# Altium schematic sheet A2.SchDoc
size A3; SheetNumber: 3; SheetTotal: 6
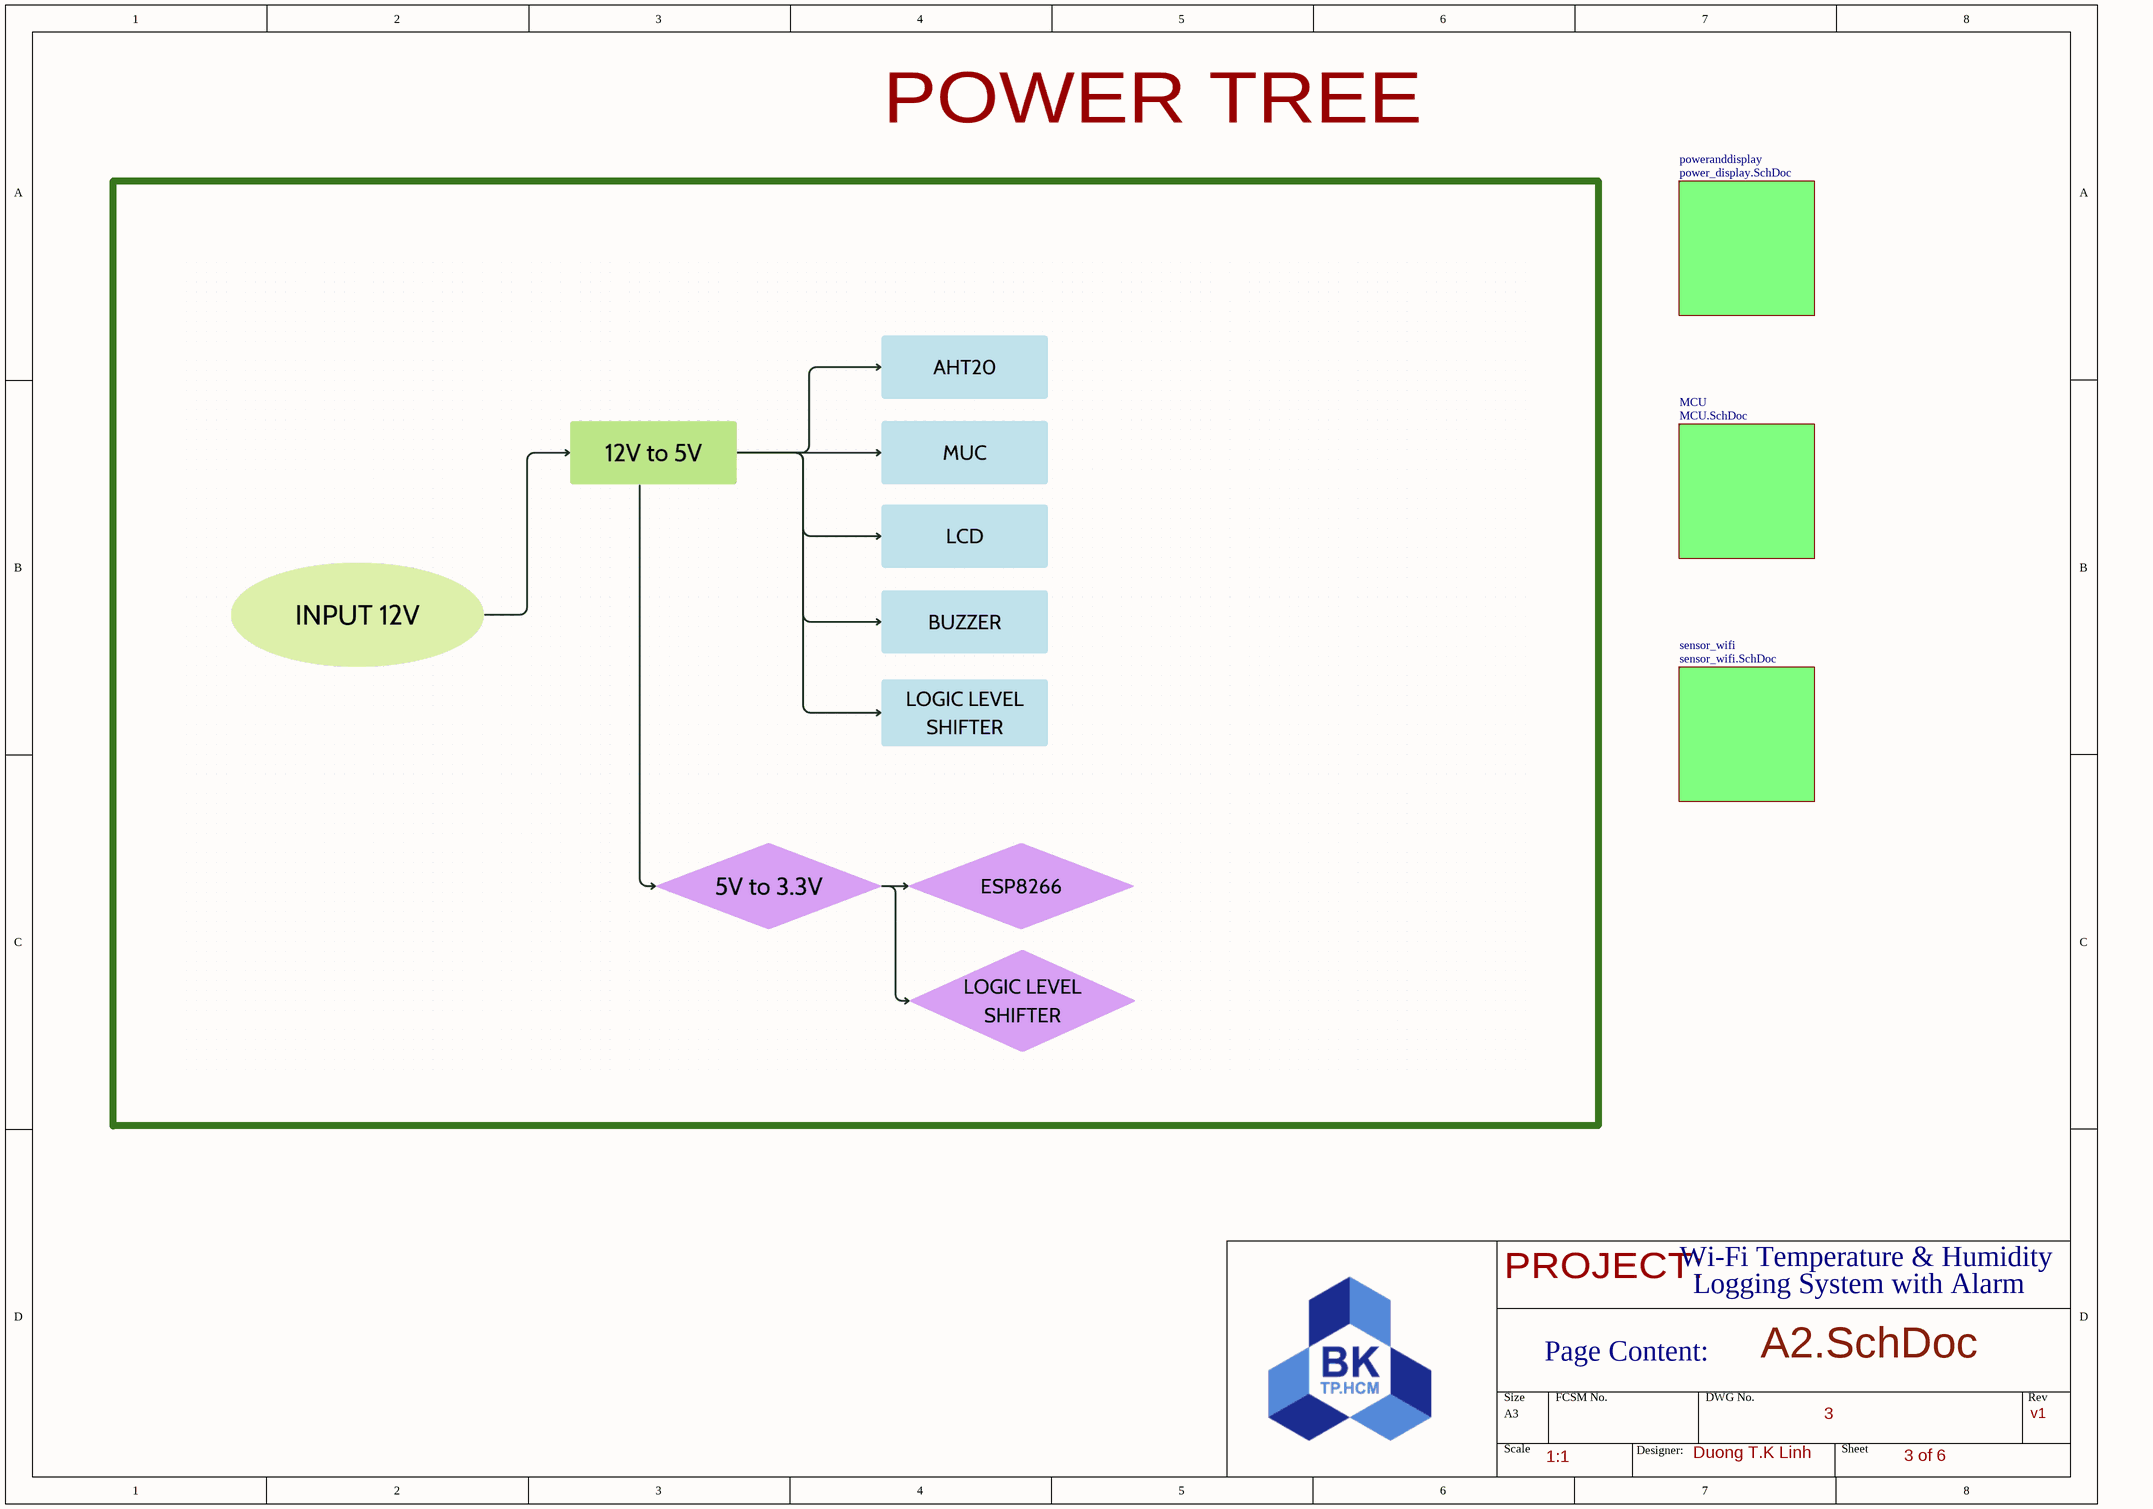
[diagram p0: A2.SchDoc]

## Sub-sheets
MCU = MCU.SchDoc: no entries
poweranddisplay = power_display.SchDoc: no entries
sensor_wifi = sensor_wifi.SchDoc: no entries

## Notes on the sheet
- POWER TREE
- PROJECT:
- Wi-Fi Temperature & Humidity
- Logging System with Alarm
- Page Content:
- A2.SchDoc
- 1:1
- Designer:
- Duong T.K Linh
- 3
- 3 of 6
- v1